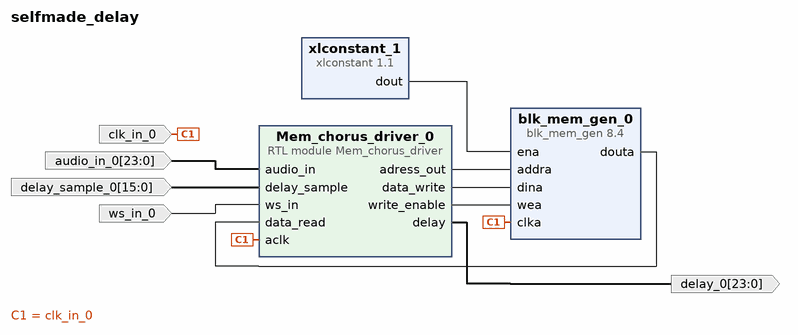
[diagram p0: block diagram of the top level]
# Vivado block design selfmade_delay, xc7a100tcsg324-1, Vivado 2022.1
create_bd_design selfmade_delay

create_bd_port -dir I ws_in_0
create_bd_port -dir I clk_in_0
create_bd_port -dir I -from 23 -to 0 audio_in_0
create_bd_port -dir O -from 23 -to 0 delay_0
create_bd_port -dir I -from 15 -to 0 delay_sample_0

create_bd_cell -type ip -vlnv xilinx.com:ip:blk_mem_gen:8.4 blk_mem_gen_0
set_property -dict [list \
  CONFIG.Enable_32bit_Address false \
  CONFIG.Operating_Mode_A NO_CHANGE \
  CONFIG.Read_Width_A 24 \
  CONFIG.Register_PortA_Output_of_Memory_Primitives true \
  CONFIG.Use_Byte_Write_Enable false \
  CONFIG.Use_RSTA_Pin false \
  CONFIG.Write_Depth_A 65536 \
  CONFIG.Write_Width_A 24 \
  CONFIG.use_bram_block Stand_Alone \
] [get_bd_cells blk_mem_gen_0]
create_bd_cell -type ip -vlnv xilinx.com:ip:xlconstant:1.1 xlconstant_1
create_bd_cell -type module -reference Mem_chorus_driver Mem_chorus_driver_0

# ---- connections ----

connect_bd_net [get_bd_pins Mem_chorus_driver_0/adress_out] [get_bd_pins blk_mem_gen_0/addra]
connect_bd_net [get_bd_pins Mem_chorus_driver_0/data_write] [get_bd_pins blk_mem_gen_0/dina]
connect_bd_net [get_bd_pins Mem_chorus_driver_0/delay] [get_bd_ports delay_0]
connect_bd_net [get_bd_pins Mem_chorus_driver_0/write_enable] [get_bd_pins blk_mem_gen_0/wea]
connect_bd_net -net audio_in_0_1 [get_bd_ports audio_in_0] [get_bd_pins Mem_chorus_driver_0/audio_in]
connect_bd_net [get_bd_pins blk_mem_gen_0/douta] [get_bd_pins Mem_chorus_driver_0/data_read]
connect_bd_net -net clk_wiz_0_clk_out1 [get_bd_ports clk_in_0] [get_bd_pins blk_mem_gen_0/clka] [get_bd_pins Mem_chorus_driver_0/aclk]
connect_bd_net -net delay_sample_0_1 [get_bd_ports delay_sample_0] [get_bd_pins Mem_chorus_driver_0/delay_sample]
connect_bd_net -net ws_in_0_1 [get_bd_ports ws_in_0] [get_bd_pins Mem_chorus_driver_0/ws_in]
connect_bd_net [get_bd_pins xlconstant_1/dout] [get_bd_pins blk_mem_gen_0/ena]

validate_bd_design
save_bd_design
